# EAGLE schematic Tarjeta regulador conmutado 12-5 volts (EAGLE 5.06)
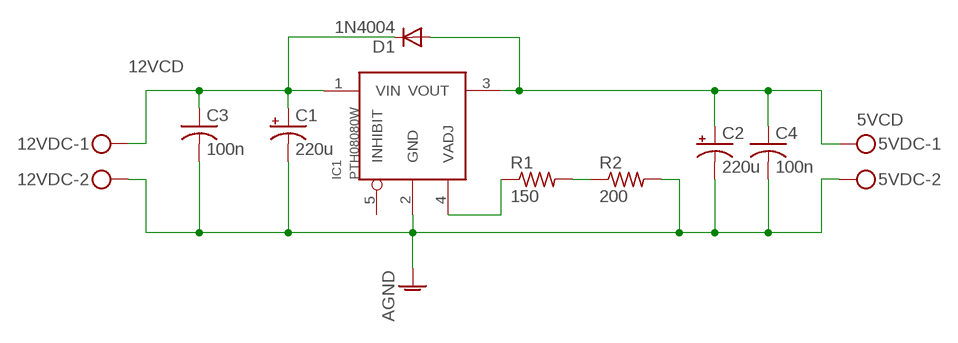
[diagram p0: schematic, sheet 1]

## Parts
5VDC  MKDSN1,5/2-5,08  [MKDSN1,5/2-5,08]
12VDC  MKDSN1,5/2-5,08  [MKDSN1,5/2-5,08]
C1  220u  CPOL-USE2.5-5  [E2,5-5]
C2  220u  CPOL-USE2.5-5  [E2,5-5]
C3  100n  C-US025-025X050  [C025-025X050]
C4  100n  C-US025-025X050  [C025-025X050]
D1  1N4004  [DO41-10]
IC1  PTH08080W  [PLACA_XTEND_RF]
R1  150  R-US_M1206  [M1206]
R2  200  R-US_M1206  [M1206]

## Nets
5VCD: 5VDC.1 C2.+ C4.1 D1.A IC1.3(VOUT)
12VCD: 12VDC.1 C1.+ C3.1 D1.C IC1.1(VIN)
AGND: 5VDC.2 12VDC.2 C1.- C2.- C3.2 C4.2 IC1.2(GND) R2.2
N$11: IC1.4(VADJ) R1.1
N$12: R1.2 R2.1
Unconnected: IC1.5(INHIBIT)

## Library data of the parts
5VDC 12VDC = con-phoenix-508:MKDSN1,5/2-5,08: MKDSN 1,5/ 2-5,08 Printklemme Nennstrom: 13,5 A Nennspannung: 250 V Rastermaß: 5,08 mm Polzahl: 2 Anschlussart: Schraubanschluss Montage: Löten Anschlussrichtung Leiter/Platine: 0 ° Artikelnummer: 1729128 Source: http://eshop.phoenixcontact.com .. 1729128.pdf
C1 C2 = rcl:CPOL-US: POLARIZED CAPACITOR, American symbol
C3 C4 = rcl:C-US: CAPACITOR, American symbol
D1 = diode:1N4004: DIODE general purpose rectifier, 1 A
IC1 = cornejoso:PTH08080W
R1 R2 = rcl:R-US_: RESISTOR, American symbol